# EAGLE design breakoutModule (EAGLE 7.1.0)
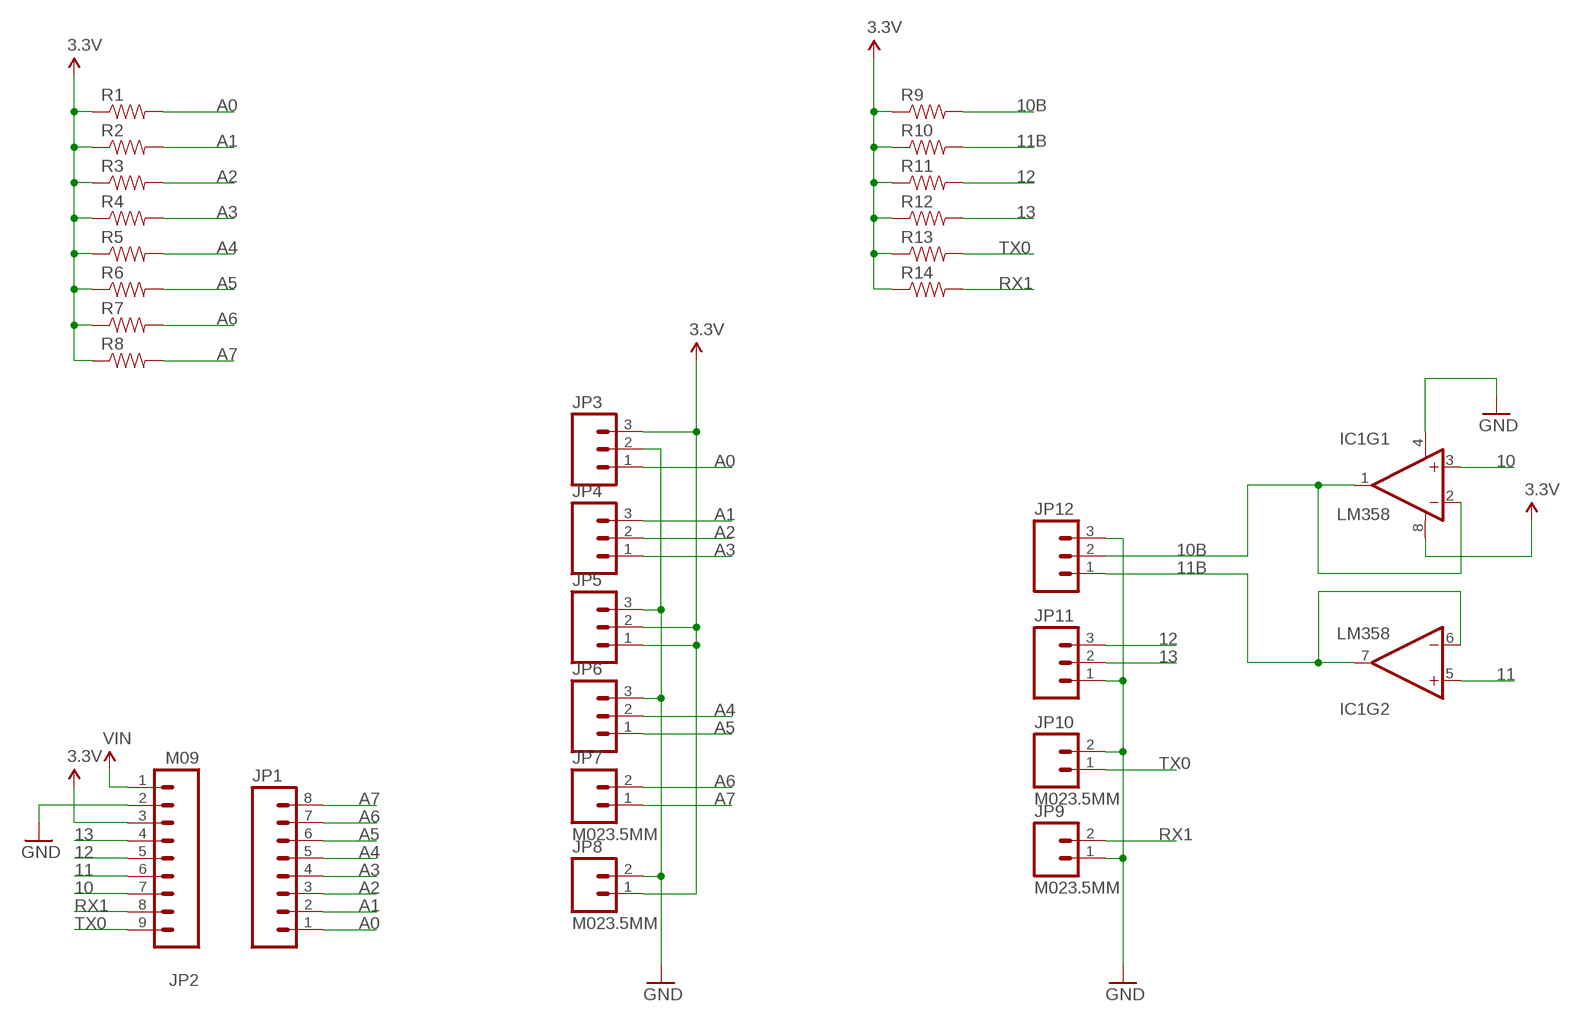
[diagram p0: schematic, sheet 1]

## Parts
IC1  LM358  [DIP08]
JP1  M081X08  [1X08]
JP2  M09  [1X09]
JP3  M03SCREW  [SCREWTERMINAL-3.5MM-3]
JP4  M03SCREW  [SCREWTERMINAL-3.5MM-3]
JP5  M03SCREW  [SCREWTERMINAL-3.5MM-3]
JP6  M03SCREW  [SCREWTERMINAL-3.5MM-3]
JP7  M023.5MM  [SCREWTERMINAL-3.5MM-2]
JP8  M023.5MM  [SCREWTERMINAL-3.5MM-2]
JP9  M023.5MM  [SCREWTERMINAL-3.5MM-2]
JP10  M023.5MM  [SCREWTERMINAL-3.5MM-2]
JP11  M03SCREW  [SCREWTERMINAL-3.5MM-3]
JP12  M03SCREW  [SCREWTERMINAL-3.5MM-3]
R1  RESISTOR1206  [1206]
R2  RESISTOR1206  [1206]
R3  RESISTOR1206  [1206]
R4  RESISTOR1206  [1206]
R5  RESISTOR1206  [1206]
R6  RESISTOR1206  [1206]
R7  RESISTOR1206  [1206]
R8  RESISTOR1206  [1206]
R9  RESISTOR1206  [1206]
R10  RESISTOR1206  [1206]
R11  RESISTOR1206  [1206]
R12  RESISTOR1206  [1206]
R13  RESISTOR1206  [1206]
R14  RESISTOR1206  [1206]

## Nets
3.3V: IC1.8(V+) JP2.3 JP3.3 JP5.1 JP5.2 JP8.1 R1.1 R2.1 R3.1 R4.1 R5.1 R6.1 R7.1 R8.1 R9.1 R10.1 R11.1 R12.1 R13.1 R14.1
10: IC1.3(+IN) JP2.7
10B: IC1.1(OUT) IC1.2(-IN) JP12.2 R9.2
11: IC1.5(+IN) JP2.6
11B: IC1.6(-IN) IC1.7(OUT) JP12.1 R10.2
12: JP2.5 JP11.3 R11.2
13: JP2.4 JP11.2 R12.2
A0: JP1.1 JP3.1 R1.2
A1: JP1.2 JP4.3 R2.2
A2: JP1.3 JP4.2 R3.2
A3: JP1.4 JP4.1 R4.2
A4: JP1.5 JP6.2 R5.2
A5: JP1.6 JP6.1 R6.2
A6: JP1.7 JP7.2 R7.2
A7: JP1.8 JP7.1 R8.2
GND: IC1.4(V-) JP2.2 JP3.2 JP5.3 JP6.3 JP8.2 JP9.1 JP10.2 JP11.1 JP12.3
RX1: JP2.8 JP9.2 R14.2
TX0: JP2.9 JP10.1 R13.2
VIN: JP2.1

## Library data of the parts
IC1 = SparkFun-AnalogIC:LM358: Jellybean op-amp; PROD_ID: IC-09172
JP1 = SparkFun-Connectors:M08: Header 8 Standard 8-pin 0.1" header. Use with straight break away headers (SKU : PRT-00116), right angle break away headers (PRT-00553), swiss pins (PRT-00743), machine pins (PRT-00117), and female headers (PRT-00115).
JP2 = SparkFun-Connectors:M09: Header 9 Standard 9-pin 0.1" header. Use with straight break away headers (SKU : PRT-00116), right angle break away headers (PRT-00553), swiss pins (PRT-00743), machine pins (PRT-00117), and female headers (PRT-00115).
JP3-JP6 JP11 JP12 = SparkFun-Connectors:M03: Header 3 Standard 3-pin 0.1" header. Use with straight break away headers (SKU : PRT-00116), right angle break away headers (PRT-00553), swiss pins (PRT-00743), machine pins (PRT-00117), and female headers (PRT-00115). Molex polarized connector foot print use with SKU : PRT-08232 with associated crimp pins and housings.
JP7-JP10 = SparkFun-Connectors:M02: Standard 2-pin 0.1" header. Use with - straight break away headers ( PRT-00116) - right angle break away headers (PRT-00553) - swiss pins (PRT-00743) - machine pins (PRT-00117) - female headers (PRT-00115) Molex polarized connector foot print use with: PRT-08233 with associated crimp pins and housings. 2.54_SCREWTERM for use with PRT-10571. 3.5mm Screw Terminal footprints for PRT-08084 5mm Screw Terminal footprints for use with PRT-08433
R1-R14 = SparkFun-Passives:RESISTOR: Resistor Basic schematic elements and footprints for 0603, 1206, and PTH resistors.

## Board
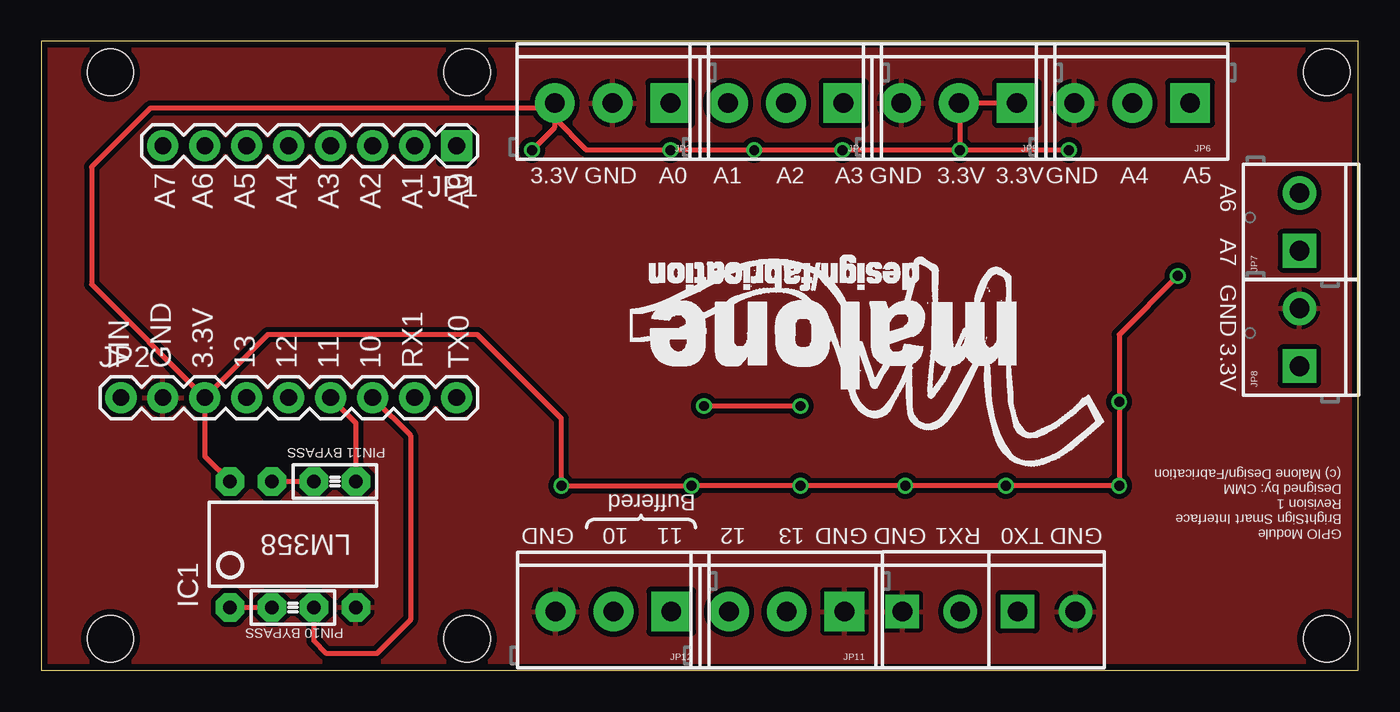
[diagram p1: board, top side]
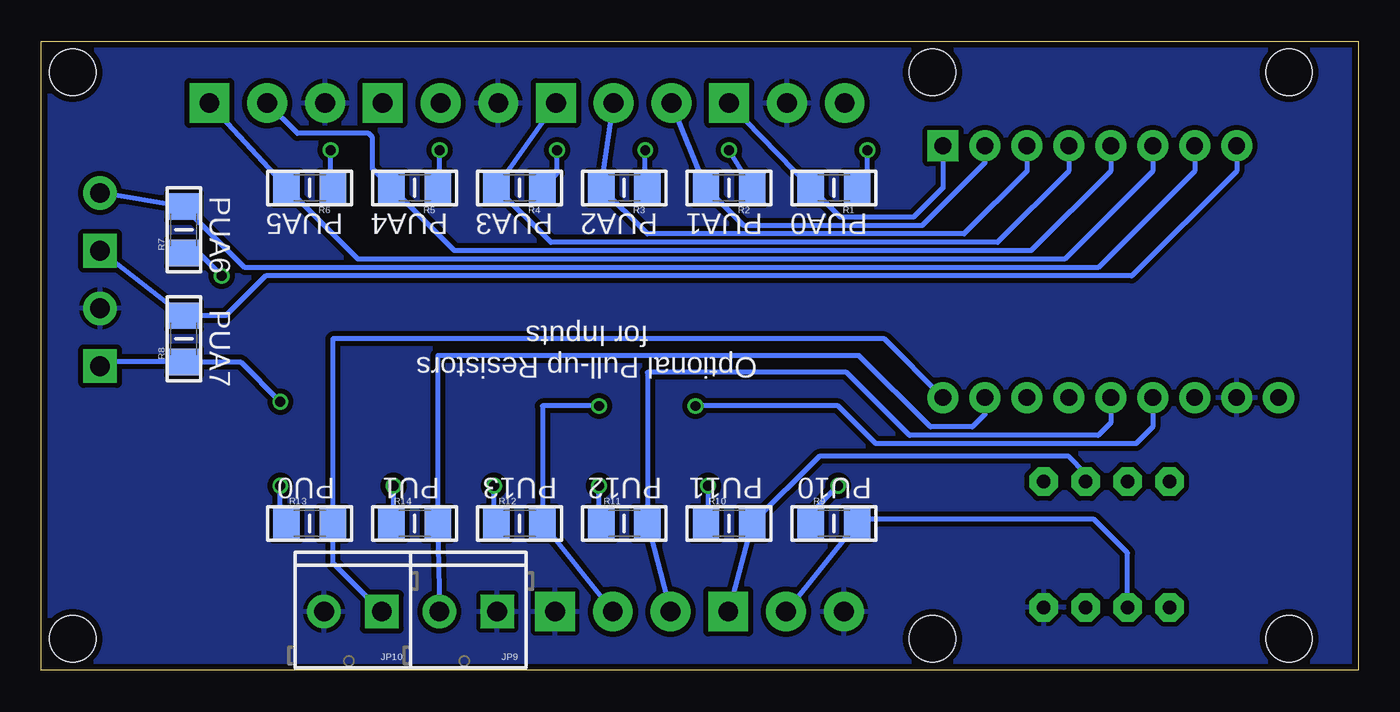
[diagram p2: board, bottom side, seen from below]

Size 79.76 x 38.08 mm. Coordinates in mm from the lower left corner, seen from the top.
Outline: 79.76,0 79.76,38.08 0,38.08 0,0 79.76,0
Copper layers (1*16): Top 0.0356mm / dielectric 1.5011mm / Bottom 0.0356mm
Design rules "LaenPCBOrder": minimum track width 6mil, minimum drill 13mil, track to track 6mil, track to pad 6mil, pad to pad 6mil, via to via 6mil, smd to smd 6mil, copper to edge 15mil, drill to drill 6mil, minimum pad ring 7mil, minimum via ring 7mil, stop-mask expansion 3mil, vias tented up to drill 0mil, thermal gap 10mil
Holes 2.8 mm at 25.78,1.91 25.78,36.2 4.19,1.91 4.19,36.2 77.85,36.2 77.85,1.91

### Footprints (pad centres in the part's own frame; a part is rotated, then mirrored left to right if it is on the bottom)
DIP08 = drill 0.813 pad 1.727 octagon: 1 -3.81,-3.81; 2 -1.27,-3.81; 3 1.27,-3.81; 4 3.81,-3.81; 5 3.81,3.81; 6 1.27,3.81; 7 -1.27,3.81; 8 -3.81,3.81
1X08 = drill 1.016 pad 1.88 square: 1 0,0 | drill 1.016 pad 1.88: 2 2.54,0; 3 5.08,0; 4 7.62,0; 5 10.16,0; 6 12.7,0; 7 15.24,0; 8 17.78,0
1X09 = drill 1.016 pad 1.88: 1 0,0; 2 2.54,0; 3 5.08,0; 4 7.62,0; 5 10.16,0; 6 12.7,0; 7 15.24,0; 8 17.78,0; 9 20.32,0
SCREWTERMINAL-3.5MM-3 = drill 1.2 pad 2.413 square: 1 0,0 | drill 1.2 pad 2.413: 2 3.5,0; 3 7,0
SCREWTERMINAL-3.5MM-2 = drill 1.2 pad 2.032 square: 1 0,0 | drill 1.2 pad 2.032: 2 3.5,0
1206 = smd 1.6 x 1.8: 1 -1.4,0; 2 1.4,0

### Placement (x,y rotation side)
IC1  15.24,7.62 0 top
JP1  25.15,31.75 180 top
JP2  4.83,16.51 0 top
JP3  38.1,34.34 180 top
JP4  48.59,34.34 180 top
JP5  59.08,34.34 180 top
JP6  69.57,34.34 180 top
JP7  76.2,25.4 90 top
JP8  76.2,18.41 90 top
JP9  52.15,3.56 180 bottom
JP10  59.13,3.56 180 bottom
JP11  48.64,3.56 180 top
JP12  38.15,3.56 180 top
R1  31.75,29.21 180 bottom
R2  38.1,29.21 180 bottom
R3  44.45,29.21 180 bottom
R4  50.8,29.21 180 bottom
R5  57.15,29.21 180 bottom
R6  63.5,29.21 180 bottom
R7  71.12,26.67 90 bottom
R8  71.12,20.07 90 bottom
R9  31.75,8.89 0 bottom
R10  38.1,8.89 0 bottom
R11  44.45,8.89 0 bottom
R12  50.8,8.89 0 bottom
R13  63.5,8.89 0 bottom
R14  57.15,8.89 0 bottom
U$1  [MALONE_LOGO]  64.26,26.42 180 top

### Tracks (layer width: path | path; a pad name or v marks a point on that pad's centre or on a via)
3.3V  (via drill 0.6)
  Top 0.305: 31.1,33.42 33.02,31.5 v38.1,31.5 v43.18,31.5 v48.51,31.5 v55.63,31.5 | 31.1,33.42 JP3.3 31.1,32.88 v29.72,31.5 | v55.63,31.5 55.63,34.3 JP5.2 JP5.1 | v62.23,31.5 v55.63,31.5 | JP2.3 9.91,12.95 IC1.8 | JP2.3 13.72,20.32 26.42,20.32 31.5,15.24 v31.5,11.18 v39.37,11.18 v45.97,11.18 v52.32,11.18 v58.42,11.18 v65.28,11.18 v65.28,16.26 65.28,20.32 v68.83,23.88 | 31.1,33.42 30.48,34.04 6.6,34.04 3.05,30.48 3.05,23.37 JP2.3
  Bottom 0.305: R2.1 v38.1,31.5 | R3.1 43.18,29.34 v43.18,31.5 | R4.1 48.51,30.1 v48.51,31.5 | R5.1 55.63,29.33 v55.63,31.5 | R6.1 62.23,29.21 v62.23,31.5 | R9.1 33.15,9.52 v31.5,11.18 | v39.37,11.18 39.37,9.02 R10.1 | R11.1 45.97,8.89 v45.97,11.18 | R12.1 52.32,8.89 v52.32,11.18 | R14.1 58.42,8.89 v58.42,11.18 | R13.1 65.28,8.89 v65.28,11.18 | v65.28,16.26 67.69,18.67 R8.1 75.95,18.67 JP8.1 | R7.1 70.23,25.27 v68.83,23.88 | R1.1 29.72,29.84 v29.72,31.5
10
  Top 0.305: JP2.7 22.35,14.22 22.35,3.05 20.32,1.02 17.27,1.02 16.51,1.78 IC1.3
10B
  Top 0.305: IC1.1 IC1.2
  Bottom 0.305: JP12.2 R9.2 30.1,9.14 16,9.14 13.97,7.11 IC1.2
11
  Top 0.305: JP2.6 19.05,14.99 IC1.5
11B
  Top 0.305: IC1.7 IC1.6
  Bottom 0.305: JP12.1 R10.2 32.64,12.95 17.53,12.95 16.51,11.94 IC1.6
12
  Bottom 0.305: JP11.3 R11.2 43.05,18.03 30.99,18.03 27.18,14.22 15.75,14.22 14.99,14.99 JP2.5
13  (via drill 0.6)
  Top 0.305: v40.13,16 v45.97,16
  Bottom 0.305: JP11.2 R12.2 49.4,16 v45.97,16 | JP2.4 12.45,14.73 13.46,13.72 29.21,13.72 31.5,16 v40.13,16
A0
  Bottom 0.305: JP1.1 25.15,29.21 26.92,27.43 31.37,27.43 R1.2 JP3.1
A1
  Bottom 0.305: JP1.2 22.61,30.73 26.42,26.92 37.21,26.92 R2.2 JP4.3
A2
  Bottom 0.305: JP1.3 20.07,30.23 23.88,26.42 43.06,26.42 R3.2 JP4.2
A3
  Bottom 0.305: JP1.4 17.53,30.23 21.84,25.91 48.9,25.91 R4.2 JP4.1
A4
  Bottom 0.305: JP1.5 14.99,30.23 19.81,25.4 54.74,25.4 R5.2 59.69,30.35 59.69,32.26 59.94,32.51 64.24,32.51 JP6.2
A5
  Bottom 0.305: JP1.6 12.45,30.23 17.78,24.89 60.58,24.89 R6.2 69.6,34.29 JP6.1
A6
  Bottom 0.305: JP1.7 9.91,30.23 15.75,24.38 67.43,24.38 R7.2 JP7.2
A7
  Bottom 0.305: JP1.8 7.37,30.23 13.72,23.88 66.16,23.88 68.57,21.47 R8.2 JP7.1
GND
  pour Top (isolate 0.305): 0,0 79.76,0 79.76,38.1 0,38.1
  pour Bottom (isolate 0.305): 0,0 79.76,0 79.76,38.1 0,38.1
RX1
  Bottom 0.305: JP9.2 R14.2 55.75,19.05 30.23,19.05 25.91,14.73 23.37,14.73 22.61,15.49 JP2.8
TX0
  Bottom 0.305: JP10.1 62.1,6.53 R13.2 62.1,20.07 28.7,20.07 JP2.9

### Text on the board
_tsilk: 3.3V | GND | A0 | A1 | A2 | A3 | GND | 3.3V | 3.3V | GND | A4 | A5 | A6 | A7 | A6 | A5 | A4 | A3 | A2 | A1 | A0 | A7 | GND | 3.3V | VIN | GND | 3.3V | 13 | 12 | 11 | 10 | RX1 | TX0 | PIN11 BYPASS | GPIO Module / BrightSign Smart Interface / Revision 1 / Designed by: CMM / (c) Malone Design/Fabrication | Buffered | GND | 10 | 11 | 12 | 13 | GND | GND | RX1 | TX0 | GND | LM358 | PIN10 BYPASS
_bsilk: PUA6 | PUA0 | PUA1 | PUA2 | PUA3 | PUA4 | PUA5 | PUA7 | Optional Pull-up Resistors / for Inputs | PU10 | PU11 | PU12 | PU13 | PU1 | PU0